# Altium schematic sheet 27ohm SCH.schdoc
size 127 x 99 mm
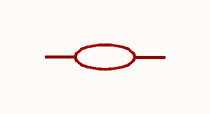
[diagram p0: 27ohm SCH.schdoc]

## Parts
R?  27Ω  [R0402]  (value not drawn)

## Nets

Not connected (* = marked no-connect by the designer): R? 1 2

## Library data of the parts
R? = RC0402FR-0727RL: RES 27 OHM 1% 1/16W 0402; Manufacturer: YAGEO(国巨); Add into BOM: yes; Temperature Coefficient: ±100ppm/℃; Symbol: RC0402FR-0727RL; Device: RC0402FR-0727RL; LCSC Part Name: 厚膜电阻 27Ω ±1% 62.5mW; Supplier Part: C138021; Manufacturer Part: RC0402FR-0727RL; Supplier Footprint: 0402; JLCPCB Part Class: Extended Part; Datasheet: https://atta.szlcsc.com/upload/public/pdf/source/20181009/C309620_DA5935B6E1D48212CB7A533FE518B3C2.pdf; Supplier: LCSC; Convert to PCB: yes; Type: Thick Film Resistors; Value: 27Ω; Tolerance: ±1%; Operating Temperature Range: -55℃~+155℃; LCSC Part Number: C138021